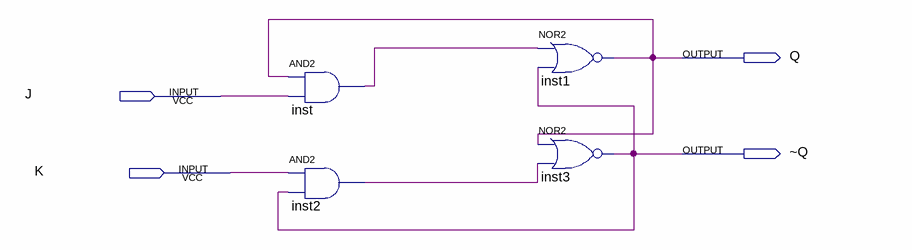
[diagram p0: schematic sheet]
// Quartus schematic jklatch.bdf as structural Verilog: 4 symbols, 4 pins
module jklatch (
  input  J,
  input  K,
  output Q,
  output \~Q 
);

  wire inst2_out, inst_out;

  and inst (inst_out, Q, J);
  and inst2 (inst2_out, K, \~Q );
  nor inst1 (Q, inst_out, \~Q );
  nor inst3 (\~Q , Q, inst2_out);
endmodule
